# Altium schematic sheet PIC32MX220F032B.SchDoc
size A4
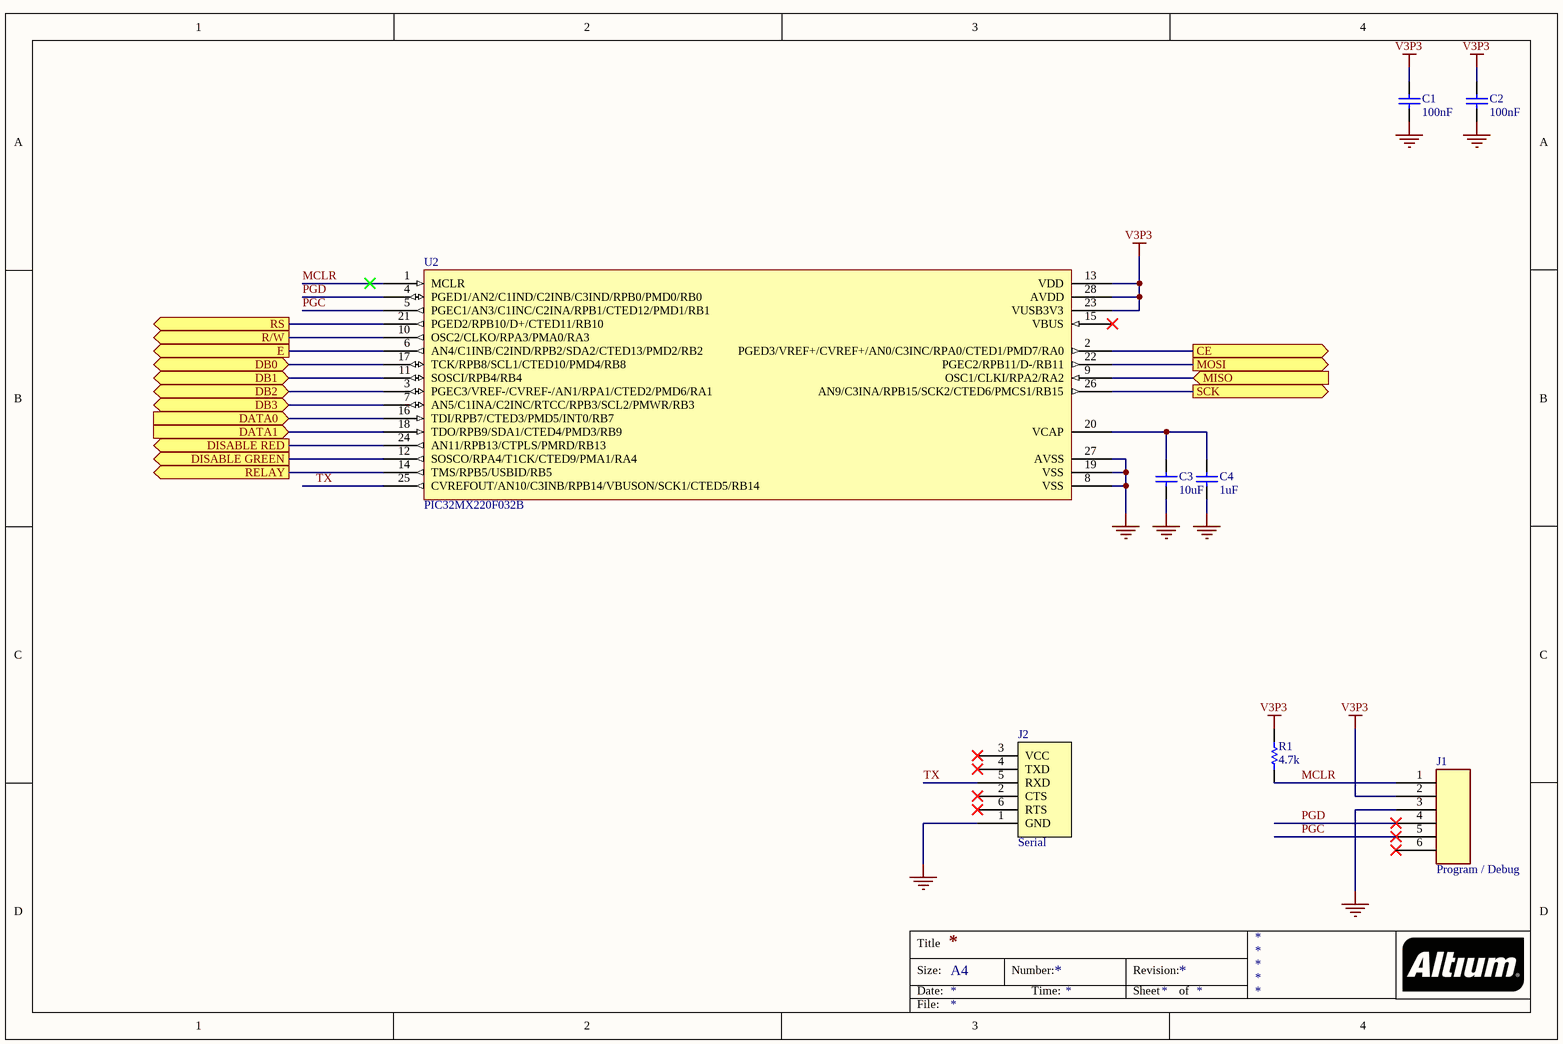
[diagram p0: PIC32MX220F032B.SchDoc]

## Parts
C1  100nF  [CAP 0603]  (no BOM)
C2  100nF  [CAP 0603]  (no BOM)
C3  10uF  [CAP 0603]  (no BOM)
C4  1uF  [CAP 0603]  (no BOM)
J1  Program / Debug  [RJ12_90]  (no BOM)
J2  Serial  [Header 6 pin]
R1  4.7k  [RES 0603]  (no BOM)
U2  PIC32MX220F032B  [SOIC (28)]

## Ports
CE (out), DATA0 (in), DATA1 (in), DB0 (bidir), DB1 (bidir), DB2 (bidir), DB3 (bidir), DISABLE GREEN (out), DISABLE RED (out), E (out), MISO (in), MOSI (out), R/W (out), RELAY (out), RS (out), SCK (out)

## Nets
GND: C1.1 C2.1 C3.1 C4.2 J1.3 J2.1(GND) U2.8(VSS) U2.19(VSS) U2.27(AVSS)
V3P3: C1.2 C2.2 J1.2 R1.2 U2.13(VDD) U2.23(VUSB3V3) U2.28(AVDD)
CE: U2.2(PGED3/VREF+/CVREF+/AN0/C3INC/RPA0/CTED1/PMD7/RA0) ; port CE
DATA0: U2.16(TDI/RPB7/CTED3/PMD5/INT0/RB7) ; port DATA0
DATA1: U2.18(TDO/RPB9/SDA1/CTED4/PMD3/RB9) ; port DATA1
DB0: U2.17(TCK/RPB8/SCL1/CTED10/PMD4/RB8) ; port DB0
DB1: U2.11(SOSCI/RPB4/RB4) ; port DB1
DB2: U2.3(PGEC3/VREF-/CVREF-/AN1/RPA1/CTED2/PMD6/RA1) ; port DB2
DB3: U2.7(AN5/C1INA/C2INC/RTCC/RPB3/SCL2/PMWR/RB3) ; port DB3
DISABLE GREEN: U2.12(SOSCO/RPA4/T1CK/CTED9/PMA1/RA4) ; port DISABLE GREEN
DISABLE RED: U2.24(AN11/RPB13/CTPLS/PMRD/RB13) ; port DISABLE RED
E: U2.6(AN4/C1INB/C2IND/RPB2/SDA2/CTED13/PMD2/RB2) ; port E
MCLR: J1.1 R1.1 U2.1(MCLR)
MISO: U2.9(OSC1/CLKI/RPA2/RA2) ; port MISO
MOSI: U2.22(PGEC2/RPB11/D-/RB11) ; port MOSI
PGC: J1.5 U2.5(PGEC1/AN3/C1INC/C2INA/RPB1/CTED12/PMD1/RB1)
PGD: J1.4 U2.4(PGED1/AN2/C1IND/C2INB/C3IND/RPB0/PMD0/RB0)
R/W: U2.10(OSC2/CLKO/RPA3/PMA0/RA3) ; port R/W
RELAY: U2.14(TMS/RPB5/USBID/RB5) ; port RELAY
RS: U2.21(PGED2/RPB10/D+/CTED11/RB10) ; port RS
SCK: U2.26(AN9/C3INA/RPB15/SCK2/CTED6/PMCS1/RB15) ; port SCK
TX: J2.5(RXD) U2.25(CVREFOUT/AN10/C3INB/RPB14/VBUSON/SCK1/CTED5/RB14)
NetC3_2: C3.2 C4.1 U2.20(VCAP)

Not connected (* = marked no-connect by the designer): J1 6(69)*; J2 2(CTS)* 3(VCC)* 4(TXD)* 6(RTS)*; U2 15(VBUS)*

## Notes on the sheet
- Title
- Size:
- Date:
- A4
- Number:
- Time:
- Revision:
- Sheet
- of
- File:

## Library data of the parts
C1 C2 = Cap: Capacitor; Precision: 50V X5R; Fournisseur: Farnell; RefFabricant: 0805B104K500CT; RefFournisseur: 2496944; Fabricant: WALSIN; Published: 8-Jun-2000; LatestRevisionDate: 17-Jul-2002; LatestRevisionNote: Re-released for DXP Platform.; PackageReference: RAD-0.3; Publisher: Altium Limited; PackageDescription: Radial Cap, Thru-Hole; 2 Leads; 0.3 in Pin Spacing; Value: 100nF; Type: Capacitor
C3 = Cap: Capacitor; Fabricant: TDK; RefFabricant: C2012X5R0J106M/1.25; Fournisseur: Farnell; RefFournisseur: 2309029; Precision: 6,3V X5R; Published: 8-Jun-2000; LatestRevisionDate: 17-Jul-2002; LatestRevisionNote: Re-released for DXP Platform.; PackageReference: RAD-0.3; Publisher: Altium Limited; PackageDescription: Radial Cap, Thru-Hole; 2 Leads; 0.3 in Pin Spacing; Value: 10uF
C4 = Cap: Capacitor; Precision: 6,3V X5R; Published: 8-Jun-2000; LatestRevisionDate: 17-Jul-2002; LatestRevisionNote: Re-released for DXP Platform.; PackageReference: RAD-0.3; Publisher: Altium Limited; PackageDescription: Radial Cap, Thru-Hole; 2 Leads; 0.3 in Pin Spacing; Value: 1uF; Fournisseur: *; RefFournisseur: *; Fabricant: *; RefFabricant: *
J1 = Debug: RJ11; Fabricant: Tyco; RefFabricant: 1-215876-3; Fournisseur: Farnell; RefFournisseur: 1773039
J2 = Serial: Header 6 pin
R1 = Res1: Resistor; Value: 1K; Precision: 1%; Fournisseur: Farnell; RefFournisseur: 2502463; Fabricant: WALSIN; RefFabricant: WR06X4701FTL; Published: 8-Jun-2000; LatestRevisionDate: 17-Jul-2002; LatestRevisionNote: Re-released for DXP Platform.; PackageReference: AXIAL-0.3; Publisher: Altium Limited; PackageDescription: Axial Device, Thru-Hole; 2 Leads; 0.3 in Pin Spacing
U2 = PIC32MX220F032B: Fabricant: MICROCHIP; Fournisseur: Farnell